# Altium schematic sheet resolver-excitation.SchDoc: Resolver Excitation
size A4; SheetNumber: 12; SheetTotal: 17
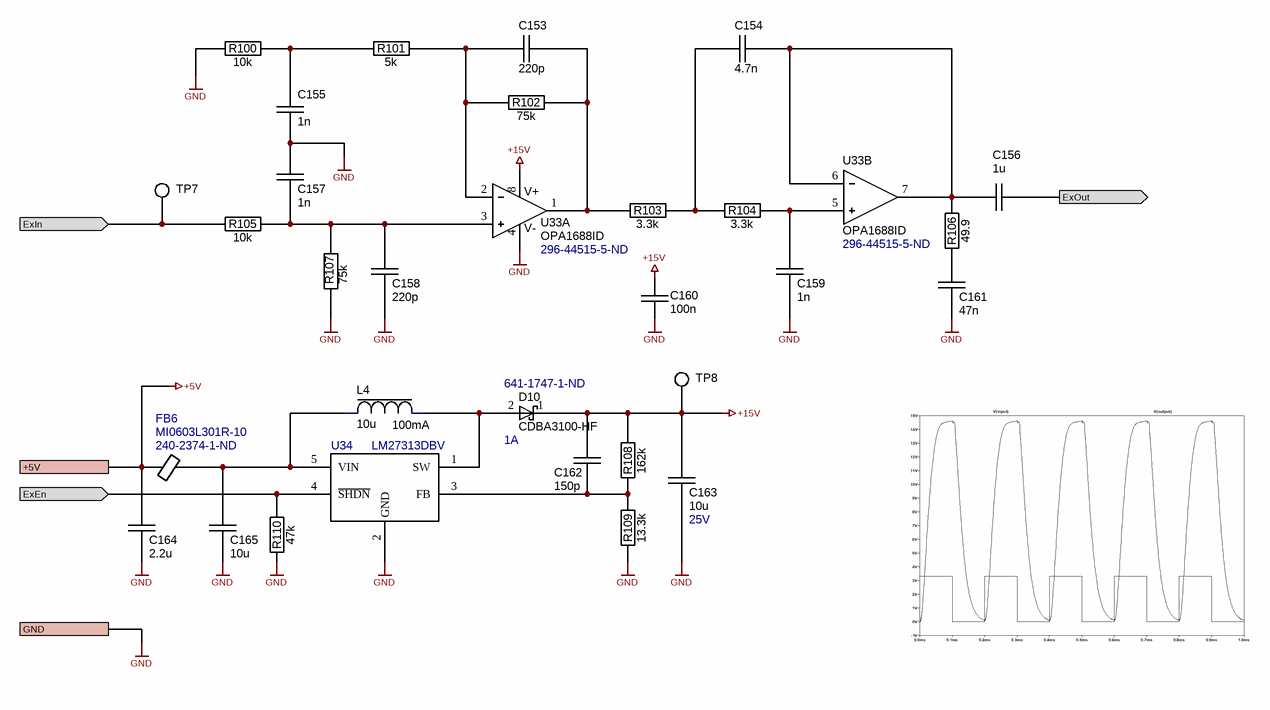
[diagram p0: resolver-excitation.SchDoc]

## Parts
C153  220p  [SM/C0402]
C154  4.7n  [SM/C0402]
C155  1n  [SM/C0402]
C156  1u  [SM/C0402]
C157  1n  [SM/C0402]
C158  220p  [SM/C0402]
C159  1n  [SM/C0402]
C160  100n  [SM/C0402]
C161  47n  [SM/C0402]
C162  150p  [SM/C0603]
C163  10u  Voltage: 25V  [SM/C0603]
C164  2.2u  [SM/C0402]
C165  10u  [SM/C0603]
D10  CDBA3100-HF  Current: 1A  Supplier Part Number 1: 641-1747-1-ND  [DO214AC]
FB6  MI0603L301R-10  Supplier Part Number 1: 240-2374-1-ND  [SM/L0603]
L4  10u  Isat: 100mA  [SM/L0805]
R100  10k  [SM/R0402]
R101  5k  [SM/R0402]
R102  75k  [SM/R0402]
R103  3.3k  [SM/R0402]
R104  3.3k  [SM/R0402]
R105  10k  [SM/R0402]
R106  49.9  [SM/R0402]
R107  75k  [SM/R0402]
R108  162k  [SM/R0402]
R109  13.3k  [SM/R0402]
R110  47k  [SM/R0402]
TP7  RCUCTE  [TP/RCUCT]  (value not drawn)
TP8  RCUCTE  [TP/RCUCT]  (value not drawn)
U33  OPA1688ID  Supplier Part Number 1: 296-44515-5-ND  [SOIC8]  (parts A,B of 2)
U34  LM27313DBV  [SOT23-6]

## Ports
+5V, ExEn (in), ExIn (in), ExOut (out), GND

## Nets
+5V: C164.1 FB6.1 ; port +5V
+15V: C160.1 C162.1 C163.1 D10.1(K) R108.1 TP8.1 U33.8(V+)
GND: C155.2 C157.1 C158.2 C159.2 C160.2 C161.2 C163.2 C164.2 C165.2 R100.2 R107.1 R109.1 R110.1 U33.4(V-) U34.2(GND) ; port GND
ExEn: R110.2 U34.4(~{SHDN}) ; port ExEn
ExIn: R105.1 TP7.1 ; port ExIn
ExOut: C156.2 ; port ExOut
NetC153_1: C153.1 R101.1 R102.2 U33.2(IN-)
NetC153_2: C153.2 R102.1 R103.2 U33.1(OUT)
NetC154_1: C154.1 R103.1 R104.2
NetC154_2: C154.2 C156.1 R106.1 U33.6(IN-) U33.7(OUT)
NetC155_1: C155.1 R100.1 R101.2
NetC157_2: C157.2 C158.1 R105.2 R107.2 U33.3(IN+)
NetC159_1: C159.1 R104.1 U33.5(IN+)
NetC161_1: C161.1 R106.2
NetC162_2: C162.2 R108.2 R109.2 U34.3(FB)
NetC165_1: C165.1 FB6.2 L4.2 U34.5(VIN)
NetD10_2: D10.2(A) L4.1 U34.1(SW)

## Notes on the sheet
- HES-SO / HEIG-VD / TIN / IAI
  Route de Cheseaux, 1
  CH-1401 Yverdon-les-Bains
  +41 24 557 73 77
  http://iai.heig-vd.ch
  iai@heig-vd.ch
- Title
- Format
- Date
- A4
- Project Name
- Author
- Project ID
- VCS
- Revision
- Page
- /
- File

## Library data of the parts
C153 C158 = C: 220 pF ±5% 50V Ceramic Capacitor C0G, NP0 0402 (1005 Metric); Dielectric: NPO; Voltage: 50V; Supplier 1: Digi-Key; Supplier Part Number 1: 1276-1059-1-ND
C154 C162 = C: Chip Capacitor; Voltage: 16V; Dielectric: X7R
C155 C157 C159 = C: GRM1555C1H102JA01D; Voltage: 50V; Dielectric: NPO; Supplier 1: Digi-Key; Supplier Part Number 1: 490-3244-1-ND; Value: 1n
C156 = C: TMK105BJ105MV-F; Voltage: 25V; Dielectric: X5R; Supplier 1: Digi-Key; Supplier Part Number 1: 587-3245-1-ND; Value: 1u
C160 = C: 0.1 µF ±10% 25V Ceramic Capacitor X5R 0402 (1005 Metric); Voltage: 25V; Dielectric: X5R; Supplier 1: Digi-Key; Supplier Part Number 1: 1276-1043-1-ND; Value: 100n
C161 = C: 0.047 µF ±10% 25V Ceramic Capacitor X7R 0402 (1005 Metric); Voltage: 25V; Dielectric: X7R; Supplier 1: Digi-Key; Supplier Part Number 1: 1276-CL05B473KA5VPNCCT-ND; Value: 47n
C163 = C: 10 µF ±20% 25V Ceramic Capacitor X5R 0603 (1608 Metric); Dielectric: X7R; Supplier 1: Digi-Key; Supplier Part Number 1: 490-7202-1-ND; Value: 10u
C164 = C: CAP CER 10UF 10V X5R 0805; Supplier 1: Digi-Key; Supplier Part Number 1: 1276-2402-1-ND
C165 = C: 10 µF ±20% 25V Ceramic Capacitor X5R 0603 (1608 Metric); Voltage: 16V; Dielectric: X7R; Supplier 1: Digi-Key; Supplier Part Number 1: 490-7202-1-ND; Value: 10u
D10 = D SCHOTTKY: Supplier 1: Digi-Key
FB6 = FB0603: Supplier 1: Digi-Key
L4 = L: FIXED IND 10UH 300MA 845MOHM SMD; Value: 10u; Supplier 1: Digi-Key; Supplier Part Number 1: 490-18463-1-ND
R100 R105 = R: 10 kOhms ±1% 0.063W, 1/16W Chip Resistor 0402 (1005 Metric) Moisture Resistant Thick Film; Supplier 1: Digi-Key; Supplier Part Number 1: 1276-3431-1-ND; Value: 10k
R101 = R: 5 kOhms ±1% 0.063W, 1/16W Chip Resistor 0402 (1005 Metric) Moisture Resistant Thick Film; Supplier 1: Digi-Key; Supplier Part Number 1: 13-RC0402FR-075KLCT-ND; Value: 5k
R102 R107 = R: 75 kOhms ±1% 0.063W, 1/16W Chip Resistor 0402 (1005 Metric) Moisture Resistant Thick Film; Supplier 1: Digi-Key; Supplier Part Number 1: 311-75KLRCT-ND; Value: 75k
R103 R104 = R: 3.3 kOhms ±1% 0.063W, 1/16W Chip Resistor 0402 (1005 Metric) Moisture Resistant Thick Film; Supplier 1: Digi-Key; Supplier Part Number 1: 311-3.30KLRCT-ND; Value: 3.3k
R106 = R: RC0402FR-0749R9L; Supplier 1: Digi-Key; Supplier Part Number 1: 311-49.9LRCT-ND; Value: 49.9
R108 = R: Chip Resistor SMD
R109 = R: 13.3 kOhms ±1% 0.063W, 1/16W Chip Resistor 0402 (1005 Metric) Moisture Resistant Thick Film; Supplier 1: Digi-Key; Supplier Part Number 1: YAG2974CT-ND; Value: 13.3k
R110 = R: 47 kOhms ±1% 0.063W, 1/16W Chip Resistor 0402 (1005 Metric) Moisture Resistant Thick Film; Supplier 1: Digi-Key; Supplier Part Number 1: 311-47.0KLRCT-ND
TP7 TP8 = TP: PC Test Point Plating Surface Mount Mounting Type; Supplier 1: Digi-Key; Supplier Part Number 1: 2019-RCUCTECT-ND
U33 = OPA1688: Dual operational amplifier; Supplier 1: Digi-Key
U34 = LM27313DBV: Boost Switching Regulator IC Positive Adjustable 5V 1 Output 800mA (Switch) SC-74A, SOT-753; Supplier 1: Digi-Key; Supplier Part Number 1: LM27313XMF/NOPBCT-ND